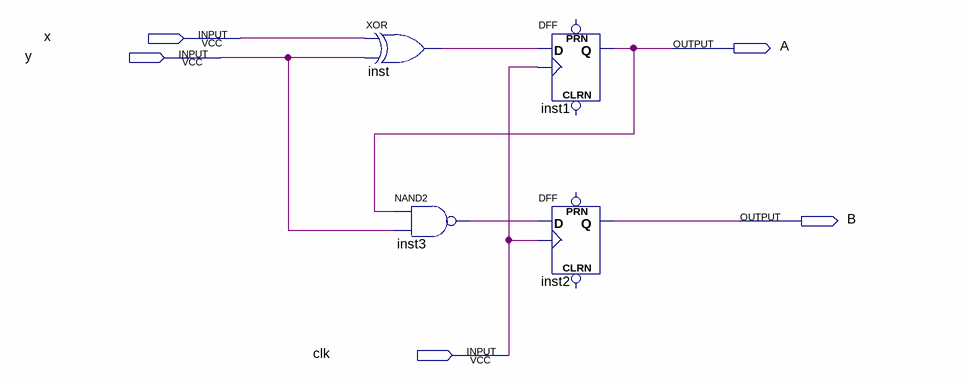
[diagram p0: schematic sheet]
// Quartus schematic task1.bdf as structural Verilog: 4 symbols, 5 pins
module task1 (
  input  x,
  input  y,
  input  clk,
  output A,
  output B
);

  wire inst3_out, inst_out;

  xor inst (inst_out, x, y);
  nand inst3 (inst3_out, A, y);
  DFF inst1 (.CLK(clk), .D(inst_out), .Q(A));  // open: CLRN, PRN
  DFF inst2 (.CLK(clk), .D(inst3_out), .Q(B));  // open: CLRN, PRN
endmodule
